# EAGLE design 4313 Breakout V2 (EAGLE 6.5.0)
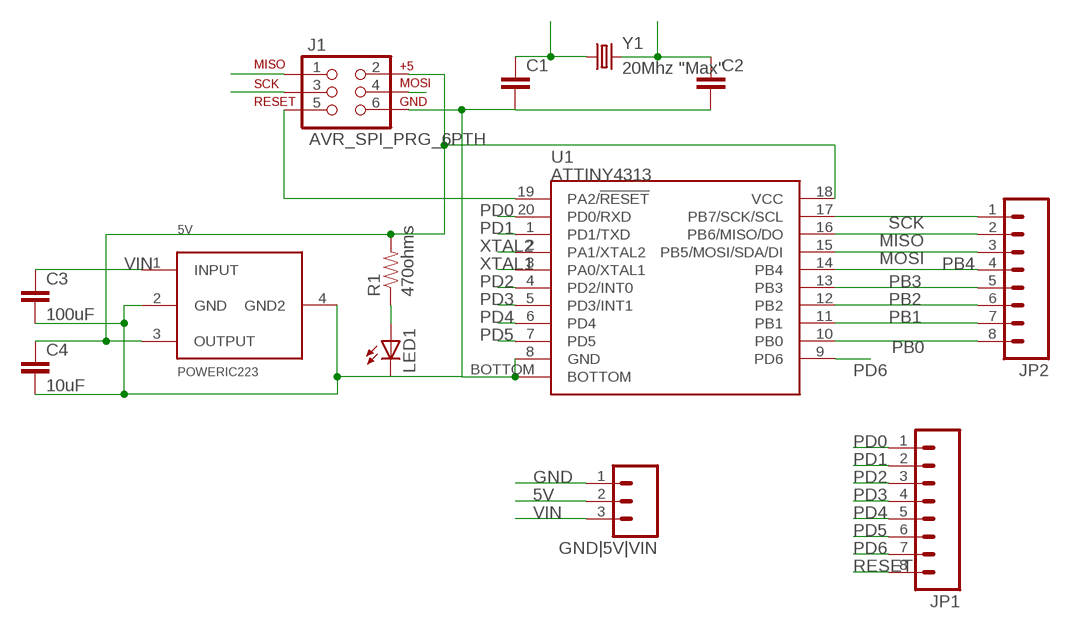
[diagram p0: schematic, sheet 1]

## Parts
5V  POWERIC223  [SOT223]
C1  CAP1206  [1206]
C2  CAP1206  [1206]
C3  100uF  CAP1210  [1210]
C4  10uF  CAP1210  [1210]
GND|5V|VIN  M03PTH  [1X03]
J1  AVR_SPI_PRG_6PTH  [2X3]
JP1  M081X08  [1X08]
JP2  M081X08  [1X08]
LED1  LED1206  [LED-1206]
R1  470ohms  RESISTOR1206  [1206]
U1  ATTINY4313  [MLF-20]
Y1  20Mhz "Max"  CRYSTAL5X3  [CRYSTAL-SMD-5X3]

## Nets
5V: 5V.3(OUTPUT) C4.1 GND|5V|VIN.2 J1.2 R1.2 U1.18(VCC)
GND: 5V.2(GND) 5V.4(GND2) C1.2 C2.2 C3.2 C4.2 GND|5V|VIN.1 J1.6 LED1.C U1.8(GND) U1.BOTTOM
MISO: J1.1 JP2.2 U1.16(PB6/MISO/DO)
MOSI: J1.4 JP2.3 U1.15(PB5/MOSI/SDA/DI)
N$1: LED1.A R1.1
PB0: JP2.8 U1.10(PB0)
PB1: JP2.7 U1.11(PB1)
PB2: JP2.6 U1.12(PB2)
PB3: JP2.5 U1.13(PB3)
PB4: JP2.4 U1.14(PB4)
PD0: JP1.1 U1.20(PD0/RXD)
PD1: JP1.2 U1.1(PD1/TXD)
PD2: JP1.3 U1.4(PD2/INT0)
PD3: JP1.4 U1.5(PD3/INT1)
PD4: JP1.5 U1.6(PD4)
PD5: JP1.6 U1.7(PD5)
PD6: JP1.7 U1.9(PD6)
RESET: J1.5 JP1.8 U1.19(PA2/!RESET)
SCK: J1.3 JP2.1 U1.17(PB7/SCK/SCL)
VIN: 5V.1(INPUT) C3.1 GND|5V|VIN.3
XTAL1: C1.1 U1.3(PA0/XTAL1) Y1.1
XTAL2: C2.1 U1.2(PA1/XTAL2) Y1.3

## Library data of the parts
5V = NU STEM:POWERIC223
C1 C2 = SparkFun-Passives:CAP: Capacitor Standard 0603 ceramic capacitor, and 0.1" leaded capacitor.
C3 C4 = SparkFun-Capacitors:CAP: Capacitor Standard 0603 ceramic capacitor, and 0.1" leaded capacitor.
GND|5V|VIN = SparkFun-Connectors:M03: Header 3 Standard 3-pin 0.1" header. Use with straight break away headers (SKU : PRT-00116), right angle break away headers (PRT-00553), swiss pins (PRT-00743), machine pins (PRT-00117), and female headers (PRT-00115). Molex polarized connector foot print use with SKU : PRT-08232 with associated crimp pins and housings.
J1 = SparkFun-Connectors:AVR_SPI_PRG_6: AVR ISP 6 Pin This is the reduced ISP connector for AVR programming. Common on Arduino. This footprint will take up less PCB space and can be used with a 10-pin to 6-pin adapter such as SKU: BOB-08508
JP1 JP2 = SparkFun-Connectors:M08: Header 8 Standard 8-pin 0.1" header. Use with straight break away headers (SKU : PRT-00116), right angle break away headers (PRT-00553), swiss pins (PRT-00743), machine pins (PRT-00117), and female headers (PRT-00115).
LED1 = SparkFun-LED:LED: LEDs Standard schematic elements and footprints for 5mm, 3mm, 1206, and 0603 sized LEDs. 5mm - Spark Fun Electronics SKU : COM-00529 (and others)
R1 = SparkFun-Resistors:RESISTOR: Resistor Basic schematic elements and footprints for 0603, 1206, and PTH resistors.
U1 = NU STEM:ATTINY4313
Y1 = SparkFun-FreqCtrl:CRYSTAL: Various standard crystals. Proven footprints. Spark Fun Electronics SKU : COM-00534

## Board
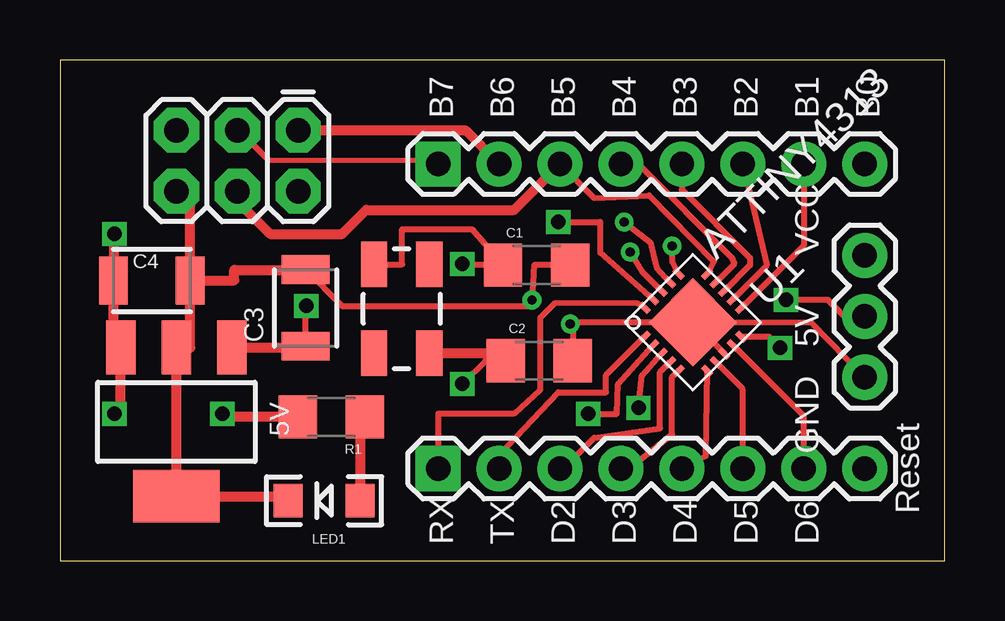
[diagram p1: board, top side]
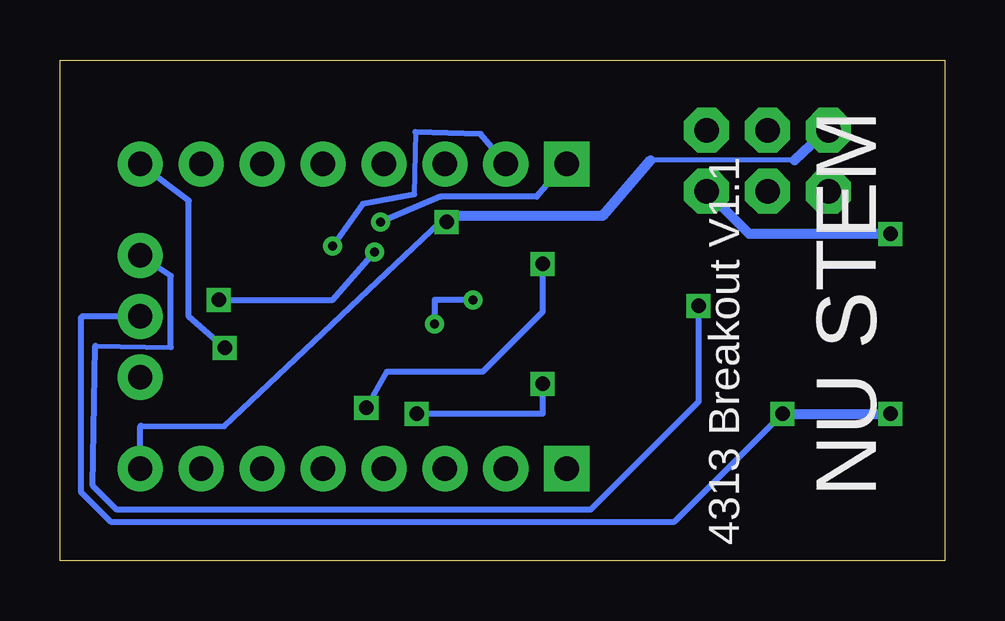
[diagram p2: board, bottom side, seen from below]

Size 36.89 x 20.89 mm. Coordinates in mm from the lower left corner, seen from the top.
Outline: 0,0 36.89,0 36.89,20.89 0,20.89 0,0
Copper layers (1*16): Top 0.035mm / dielectric 1.5mm / Bottom 0.035mm
Design rules "default *": minimum track width 6mil, minimum drill 13mil, track to track 8mil, track to pad 8mil, pad to pad 8mil, via to via 8mil, smd to smd 8mil, copper to edge 15mil, drill to drill 8mil, minimum pad ring 10mil, minimum via ring 8mil, stop-mask expansion 4mil, vias tented up to drill 0mil, thermal gap 10mil

### Footprints (pad centres in the part's own frame; a part is rotated, then mirrored left to right if it is on the bottom)
SOT223 = smd 1.219 x 2.235: 1 -2.311,-3.099; 2 0,-3.099; 3 2.311,-3.099 | smd 3.6 x 2.2: 4 0,3.099
1206 = smd 1.6 x 1.8: 1 -1.4,0; 2 1.4,0
1210 = smd 1.2 x 2: 1 -1.6,0; 2 1.6,0
1X03 = drill 1.016 pad 1.88: 1 0,0; 2 2.54,0; 3 5.08,0
2X3 = drill 1.016 pad 1.88 octagon: 1 0,0; 2 0,2.54; 3 2.54,0; 4 2.54,2.54; 5 5.08,0; 6 5.08,2.54
1X08 = drill 1.016 pad 1.88 square: 1 0,0 | drill 1.016 pad 1.88: 2 2.54,0; 3 5.08,0; 4 7.62,0; 5 10.16,0; 6 12.7,0; 7 15.24,0; 8 17.78,0
LED-1206 = smd 1.2 x 1.4: A -1.5,0; C 1.5,0
MLF-20 = smd 0.5 x 0.23: 1 -1.85,1; 2 -1.85,0.5; 3 -1.85,0; 4 -1.85,-0.5; 5 -1.85,-1; 11 1.85,-1; 12 1.85,-0.5; 13 1.85,0; 14 1.85,0.5; 15 1.85,1 | smd 0.23 x 0.5: 6 -1,-1.85; 7 -0.5,-1.85; 8 0,-1.85; 9 0.5,-1.85; 10 1,-1.85; 16 1,1.85; 17 0.5,1.85; 18 0,1.85; 19 -0.5,1.85; 20 -1,1.85 | smd 2.6 x 2.6: BOTTOM 0,0
CRYSTAL-SMD-5X3 = smd 1.9 x 1.1: 1 -1.85,-1.15; 2 1.85,-1.15; 3 1.85,1.15; 4 -1.85,1.15

### Placement (x,y rotation side)
5V  4.85,5.8 180 top
C1  19.87,12.33 0 top
C2  19.98,8.34 0 top
C3  10.25,10.55 90 top
C4  3.83,11.7 0 top
GND|5V|VIN  33.55,7.66 90 top
J1  9.94,17.95 180 top
JP1  15.77,3.85 0 top
JP2  15.77,16.55 0 top
LED1  11.02,2.51 180 top
R1  11.31,6 180 top
U1  26.38,9.95 45 top
Y1  14.25,10.51 270 top

### Tracks (layer width: path | path; a pad name or v marks a point on that pad's centre or on a via)
5V  (via drill 0.38, 0.6)
  Top 0.254: GND|5V|VIN.2 32.7,10.2 32.02,10.88 v30.27,10.88 | v23.77,12.88 24.27,12.06 U1.18
  Top 0.406: R1.2 6.77,6 v6.77,6.14 | v2.27,6.14 2.54,6.14 5V.3 2.23,8.9 C4.1 2.27,11.7 v2.27,13.63
  Bottom 0.254: GND|5V|VIN.2 35.95,10.2 36.02,10.13 36.02,2.88 34.77,1.64 11.27,1.64 v6.77,6.14 | v30.27,10.88 25.52,10.88 v23.77,12.88
  Bottom 0.406: v6.77,6.14 v2.27,6.14 | v2.27,13.63 8.16,13.63 J1.2
GND  (via drill 0.38)
  Top 0.254: C1.2 19.77,12.33 v19.67,10.88 19.52,10.63 11.77,10.63 C3.2 | C2.2 21.38,9.88 v21.27,9.88 21.33,9.95 U1.BOTTOM | U1.8 U1.BOTTOM | U1.BOTTOM 31.3,9.97 GND|5V|VIN.1
  Top 0.406: C4.2 7.27,11.7 7.27,12.13 C3.2 | C4.2 5.43,8.9 5V.2 5V.4 9.52,2.7 LED1.C | C4.2 5.43,14.84 J1.6
  Bottom 0.254: v19.67,10.88 21.27,10.88 v21.27,9.88
MISO  (via drill 0.38)
  Top 0.254: v25.52,13.13 25.52,12.48 U1.16
  Top 0.406: J1.1 16.9,17.95 JP2.2
  Bottom 0.203: 22.07,17.88 22.12,15.29
  Bottom 0.254: JP2.2 19.36,17.8 22.07,17.88 | 22.12,15.29 24.27,14.88 v25.52,13.13
MOSI
  Top 0.254: JP2.3 22.27,15.13 24.57,15.23 27.27,12.48 U1.15
  Top 0.406: J1.4 7.39,15.01 8.77,13.63 11.77,13.63 12.77,14.63 18.93,14.63 JP2.3
N$1
  Top 0.406: R1.1 12.52,6 LED1.A
PB0  (via drill 0.6)
  Top 0.254: U1.10 29.56,9.35 v30.02,8.88
  Bottom 0.254: v30.02,8.88 31.52,10.18 31.52,15.02 JP2.8
PB1
  Top 0.254: JP2.7 31,13.16 U1.11
PB2
  Top 0.254: JP2.6 29.46,12.32 U1.12
PB3
  Top 0.254: JP2.5 25.92,15.48 28.77,12.63 28.77,12.33 U1.13
PB4
  Top 0.254: JP2.4 24.11,16.55 28.02,12.63 28.11,12.38 U1.14
PD0
  Top 0.254: U1.20 24.07,10.73 20.64,10.75 20.02,10.13 20.02,7.14 18.92,6.14 15.77,6.14 JP1.1
PD1
  Top 0.254: JP1.2 18.3,4.42 20.77,7.04 22.77,7.04 22.77,7.75 U1.1
PD2
  Top 0.254: JP1.3 20.98,3.85 22.27,5.14 25.02,5.54 25.02,7.88 U1.4
PD3
  Top 0.254: JP1.4 23.73,3.85 25.52,5.29 25.52,7.67 U1.5
PD4
  Top 0.254: JP1.5 26.92,4.37 U1.6
PD5
  Top 0.254: JP1.6 28.46,7.16 U1.7
PD6
  Top 0.254: JP1.7 31,6.04 U1.9
RESET  (via drill 0.6)
  Top 0.254: v20.77,14.13 22.52,14.13 22.52,12.86 U1.19
  Bottom 0.203: 6.27,16.7 12.27,16.7
  Bottom 0.254: JP1.8 33.55,5.61 33.52,5.64 30.04,5.61 21.02,14.13 v20.77,14.13
  Bottom 0.406: J1.5 4.95,17.95 6.27,16.7 | 12.27,16.7 14.27,14.38 20.27,14.38 v20.77,14.13
SCK  (via drill 0.38)
  Top 0.203: 8.69,16.7 15.7,16.7
  Top 0.254: 7.45,17.95 8.69,16.7 | v23.52,14.13 24.61,13.29 24.87,12.23 U1.17
  Top 0.406: J1.3 7.45,17.95 | 15.7,16.7 JP2.1
  Bottom 0.254: JP2.1 15.86,16.55 17.02,15.18 21.02,15.18 v23.52,14.13
VIN  (via drill 0.6)
  Top 0.254: C3.1 10.25,10.61 v10.27,10.63
  Top 0.406: 5V.1 10.19,8.9 C3.1
  Bottom 0.203: 35.42,8.96 32.27,8.9
  Bottom 0.254: v10.27,10.63 10.27,6.64 14.77,2.13 34.52,2.13 35.52,3.13 35.42,8.96 | 32.27,8.9 32.27,11.88 GND|5V|VIN.3
XTAL1  (via drill 0.6)
  Top 0.254: Y1.1 14.27,12.37 14.27,13.83 17.17,13.83 C1.1 16.82,12.33 v16.77,12.38 | v24.12,6.39 24.27,7.74 U1.3
  Bottom 0.254: v16.77,12.38 16.77,10.38 19.27,7.89 23.27,7.89 v24.12,6.39
XTAL2  (via drill 0.6)
  Top 0.254: C2.1 17.73,8.34 v16.77,7.39 | v22.02,6.14 23.21,6.14 23.27,7.39 U1.2
  Top 0.406: Y1.3 18.26,8.66 C2.1
  Bottom 0.254: v16.77,7.39 16.77,6.14 v22.02,6.14

### Text on the board
_tsilk: B7 | B6 | B5 | B4 | B3 | B2 | B1 | B0 | VCC | 5V | Reset | GND | RX | TX | D2 | D3 | D4 | D5 | D6
_bsilk: NU STEM | 4313 Breakout V1.1